# Altium schematic sheet Power_supply.SchDoc
size 420 x 297 mm; Address1: Address1; Address2: Address2; Address3: Address3; Address4: Address4; DocumentNumber: *Э3; SheetNumber: 8; SheetTotal: 15; DocumentType: Схема электрическая *
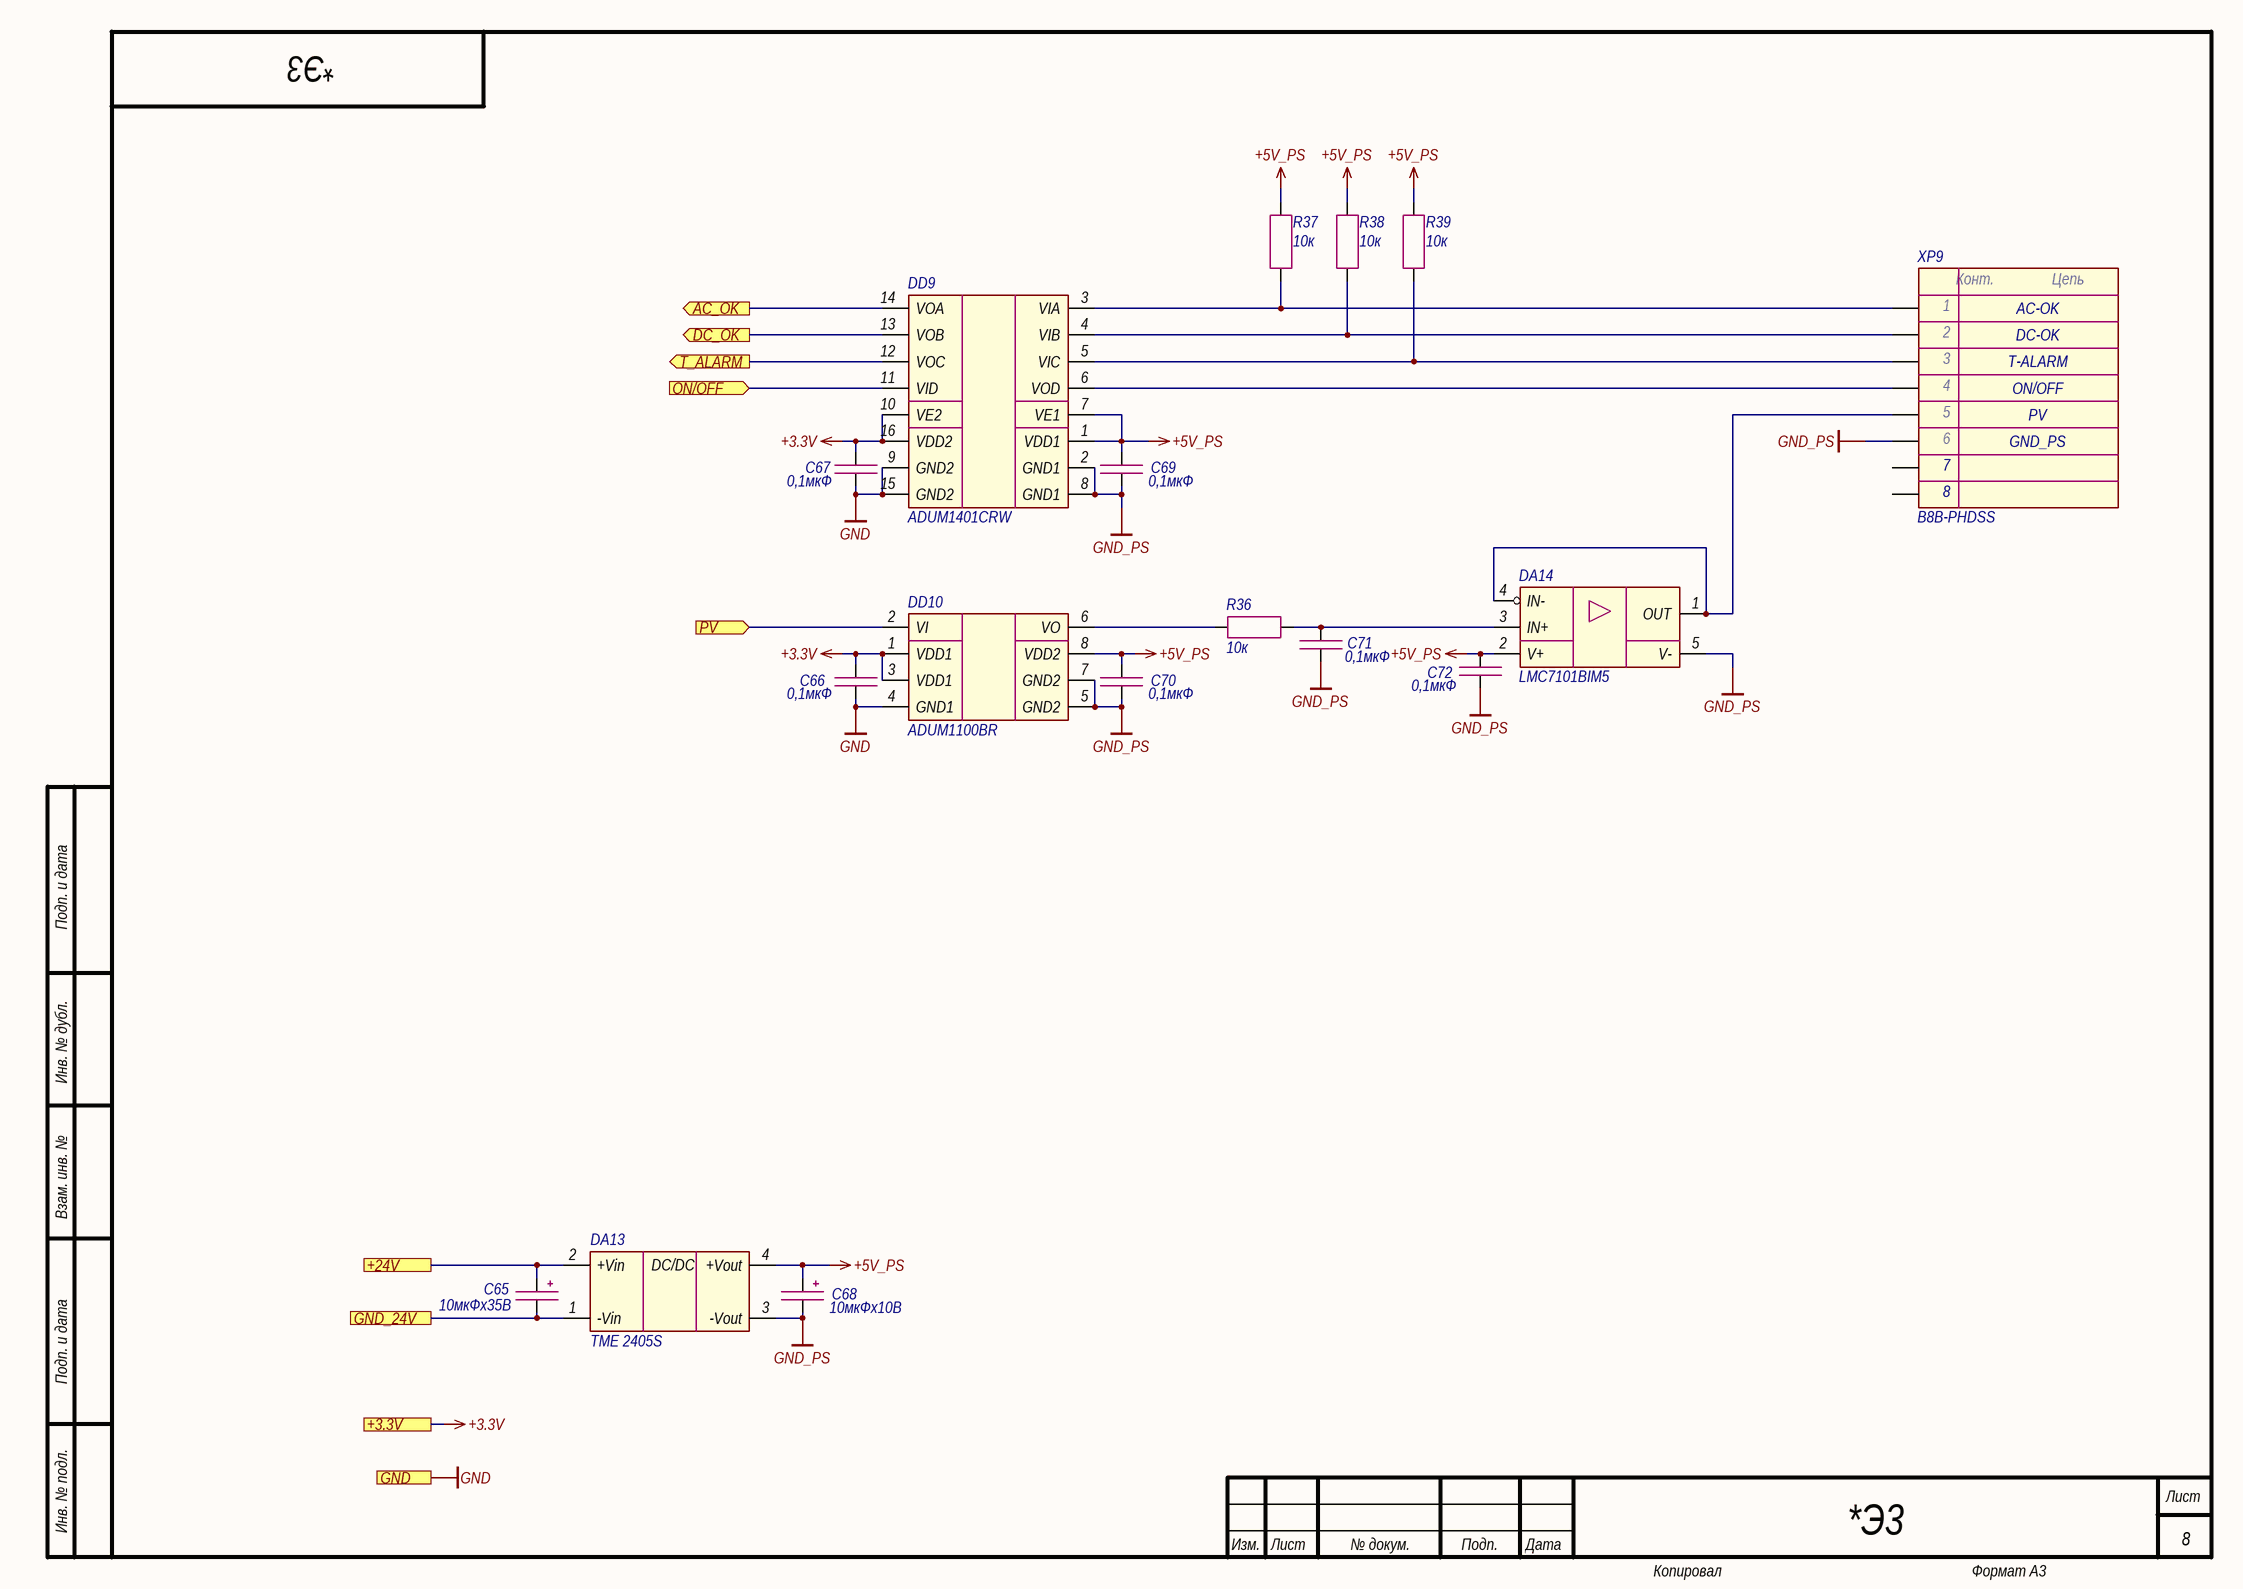
[diagram p0: Power_supply.SchDoc]

## Parts
C65  10мкФх35B  [CAP_C]
C66  0,1мкФ  [CAP_0603]
C67  0,1мкФ  [CAP_0603]
C68  10мкФх10B  [CAP_A]
C69  0,1мкФ  [CAP_0603]
C70  0,1мкФ  [CAP_0603]
C71  0,1мкФ  [CAP_0603]
C72  0,1мкФ  [CAP_0603]
DA13  TME 2405S  [TME (SIP-4)]
DA14  LMC7101BIM5  [SOT-23-5]
DD9  ADUM1401CRW  [SOIC-16W]
DD10  ADUM1100BR  [SOIC-8]
R36  10к  [RES_0603]
R37  10к  [RES_0603]
R38  10к  [RES_0603]
R39  10к  [RES_0603]
XP9  B8B-PHDSS  [B8B-PHDSS]

## Ports
+3.3V (see Main[2C], Button[1D], Ethernet[3D], Fiber_interlock[2C], Flow_sensor[2C], Hardwiring[3D], LD_driver[1D], Power_supply_CAN[1D], SF_driver[2C]), +24V (see Main[2C], Button[1C], Column[1C], Flow_sensor[2C], Hardwiring[3C], Indication[1C], LD_driver[1C], Power_supply_CAN[1D]), AC_OK (out, see Main[2C]), DC_OK (out, see Main[2C]), GND (see Main[2C], Button[1D], Column[1C], Ethernet[3D], Fiber_interlock[2C], Flow_sensor[2C], Guide_laser[1C], Hardwiring[3D], Indication[1C], LD_driver[1D], Power_supply_CAN[1D], SF_driver[2D]), GND_24V (see Main[2C], Button[1D], Column[1C], Flow_sensor[2C], Hardwiring[3C], Indication[1C], LD_driver[1D], Power_supply_CAN[1D]), ON/OFF (in, see Main[2C]), PV (in, see Main[2C]), T_ALARM (out, see Main[2C])

## Nets
+3.3V: C66.1 C67.1 DD9.10(VE2) DD9.16(VDD2) DD10.1(VDD1) DD10.3(VDD1) ; port +3.3V
+5V_PS: C68.1 C69.1 C70.1 C72.1 DA13.4(+Vout) DA14.2(V+) DD9.1(VDD1) DD9.7(VE1) DD10.8(VDD2) R37.1 R38.1 R39.1
GND: C66.2 C67.2 DD9.9(GND2) DD9.15(GND2) DD10.4(GND1) ; port GND
GND_PS: C68.2 C69.2 C70.2 C71.2 C72.2 DA13.3(-Vout) DA14.5(V-) DD9.2(GND1) DD9.8(GND1) DD10.5(GND2) DD10.7(GND2) XP9.6
+24V: C65.1 DA13.2(+Vin) ; port +24V
AC_OK: DD9.14(VOA) ; port AC_OK
DC_OK: DD9.13(VOB) ; port DC_OK
GND_24V: C65.2 DA13.1(-Vin) ; port GND_24V
ON/OFF: DD9.11(VID) ; port ON/OFF
PV: DD10.2(VI) ; port PV
T_ALARM: DD9.12(VOC) ; port T_ALARM
NetC71_1: C71.1 DA14.3(IN+) R36.2
NetDA14_1: DA14.1(OUT) DA14.4(IN-) XP9.5
NetDD9_3: DD9.3(VIA) R37.2 XP9.1
NetDD9_4: DD9.4(VIB) R38.2 XP9.2
NetDD9_5: DD9.5(VIC) R39.2 XP9.3
NetDD9_6: DD9.6(VOD) XP9.4
NetDD10_6: DD10.6(VO) R36.1

Not connected (* = marked no-connect by the designer): XP9 7 8

## Notes on the sheet
- AC-OK
- DC-OK
- T-ALARM
- ON/OFF
- GND_PS
- PV
- Подп. и дата
- Инв. № дубл.
- Взам. инв. №
- Инв. № подл.
- Изм.
- Лист
- № докум.
- Подп.
- Дата
- Копировал
- Формат А3
- (in symbol Connector-8) Конт.; Цепь
- (in symbol TME) DC/DC

## Library data of the parts
C65 = Capacitor_Polar: Model: TECAP, 10 мкФ, 35 В, тип C, 10%; Value: 10мкФх35B; Document: *; Manufacturer: *
C66 C67 C69-C72 = Capacitor: Manufacturer: Murata; Model: GRM188R71H104KA93D; Value: 0,1мкФ; Document: *
C68 = Capacitor_Polar: Model: TECAP, 10 мкФ, 10 В, тип A, 10%; Value: 10мкФх10B; Document: *; Manufacturer: *
DA13 = TME: Manufacturer: Traco Power; Model: TME 2405S; Document: *
DA14 = LMC7101: Manufacturer: Texas Instruments; Model: LMC7101BIM5; Document: *
DD9 = ADUM1401: Manufacturer: Analog Devices; Model: ADUM1401CRW; Document: *
DD10 = ADUM1100: Manufacturer: Analog Devices; Model: ADUM1100BR; Document: *
R36-R39 = Resistor: Manufacturer: Yageo; Model: RC0603FR-0710KL; Value: 10к; Document: *
XP9 = Connector-8: Manufacturer: JST; Model: B8B-PHDSS; Document: *